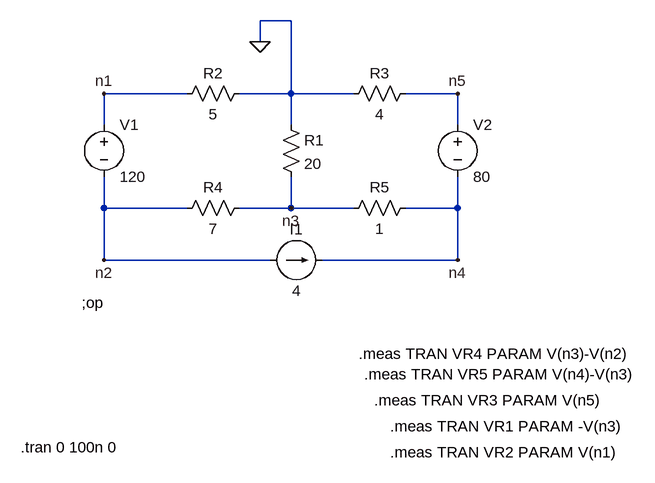
[diagram p0: schematic lab00_resistor_network.asc]
lab00_resistor_network.asc, the LTspice schematic file:
Version 4
SHEET 1 932 760
WIRE 384 -32 336 -32
WIRE 336 0 336 -32
WIRE 224 80 96 80
WIRE 384 80 384 -32
WIRE 384 80 304 80
WIRE 480 80 384 80
WIRE 640 80 560 80
WIRE 96 128 96 80
WIRE 384 128 384 80
WIRE 640 128 640 80
WIRE 96 256 96 208
WIRE 224 256 96 256
WIRE 384 256 384 208
WIRE 384 256 304 256
WIRE 480 256 384 256
WIRE 640 256 640 208
WIRE 640 256 560 256
WIRE 96 336 96 256
WIRE 352 336 96 336
WIRE 640 336 640 256
WIRE 640 336 432 336
FLAG 336 0 0
FLAG 96 80 n1
FLAG 96 336 n2
FLAG 384 256 n3
FLAG 640 336 n4
FLAG 640 80 n5
SYMBOL voltage 96 112 R0
WINDOW 123 0 0 Left 0
WINDOW 39 0 0 Left 0
SYMATTR InstName V1
SYMATTR Value 120
SYMBOL voltage 640 112 R0
WINDOW 123 0 0 Left 0
WINDOW 39 0 0 Left 0
SYMATTR InstName V2
SYMATTR Value 80
SYMBOL res 368 112 R0
SYMATTR InstName R1
SYMATTR Value 20
SYMBOL res 208 96 R270
WINDOW 0 32 56 VTop 2
WINDOW 3 0 56 VBottom 2
SYMATTR InstName R2
SYMATTR Value 5
SYMBOL res 464 96 R270
WINDOW 0 32 56 VTop 2
WINDOW 3 0 56 VBottom 2
SYMATTR InstName R3
SYMATTR Value 4
SYMBOL res 208 272 R270
WINDOW 0 32 56 VTop 2
WINDOW 3 0 56 VBottom 2
SYMATTR InstName R4
SYMATTR Value 7
SYMBOL res 464 272 R270
WINDOW 0 32 56 VTop 2
WINDOW 3 0 56 VBottom 2
SYMATTR InstName R5
SYMATTR Value 1
SYMBOL current 352 336 R270
WINDOW 0 32 40 VTop 2
WINDOW 3 -32 40 VBottom 2
WINDOW 123 0 0 Left 0
WINDOW 39 0 0 Left 0
SYMATTR InstName I1
SYMATTR Value 4
TEXT 62 402 Left 2 !;op
TEXT 488 480 Left 2 !.meas TRAN VR4 PARAM V(n3)-V(n2)
TEXT -32 624 Left 2 !.tran 0 100n 0
TEXT 496 512 Left 2 !.meas TRAN VR5 PARAM V(n4)-V(n3)
TEXT 536 632 Left 2 !.meas TRAN VR2 PARAM V(n1)
TEXT 512 552 Left 2 !.meas TRAN VR3 PARAM V(n5)
TEXT 536 592 Left 2 !.meas TRAN VR1 PARAM -V(n3)

The netlist it stands for:
* lab00_resistor_network.asc
V1 n1 n2 120
V2 n5 n4 80
R1 0 n3 20
R2 n1 0 5
R3 0 n5 4
R4 n2 n3 7
R5 n3 n4 1
I1 n2 n4 4
;op
.meas TRAN VR4 PARAM V(n3)-V(n2)
.tran 0 100n 0
.meas TRAN VR5 PARAM V(n4)-V(n3)
.meas TRAN VR2 PARAM V(n1)
.meas TRAN VR3 PARAM V(n5)
.meas TRAN VR1 PARAM -V(n3)
.backanno
.end